# Altium schematic sheet CONNECTIVE.SchDoc
size A; SheetNumber: 8; SheetTotal: 10
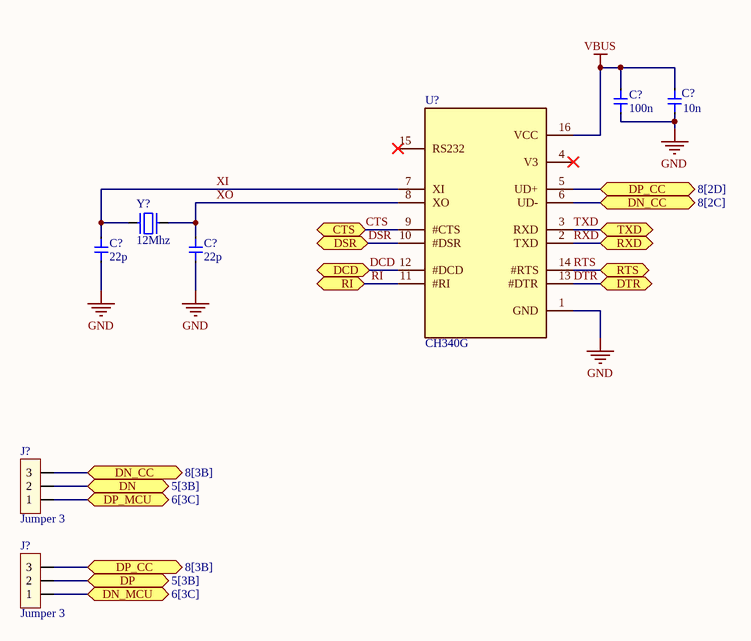
[diagram p0: CONNECTIVE.SchDoc]

## Parts
(Parts that share a designator on the sheet are numbered #1, #2 ... from top to bottom, then left to right.)
C?#1  100n  [Cap 0603]
C?#2  10n  [Cap 0603]
C?#3  22p  [Cap 0603]
C?#4  22p  [Cap 0603]
J?#1  Jumper 3  [JP3]
J?#2  Jumper 3  [JP3]
U?  CH340G  [CH340G]
Y?  12Mhz  [Thach Anh 2 chan SMD5032]

## Ports
CTS (bidir), DCD (bidir), DN (bidir, see 5[3B]), DN_CC (bidir, see 8[2C]), DN_CC (bidir, see 8[3B]), DN_MCU (bidir, see 6[3C]), DP (bidir, see 5[3B]), DP_CC (bidir, see 8[2D]), DP_CC (bidir, see 8[3B]), DP_MCU (bidir, see 6[3C]), DSR (bidir), DTR (bidir), RI (bidir), RTS (bidir), RXD (bidir), TXD (bidir)

## Nets
GND: C?#1.1 C?#2.2 C?#3.2 C?#4.2 U?.1(GND)
VBUS: C?#1.2 C?#2.1 U?.16(VCC)
CTS: U?.9(#CTS) ; port CTS
DCD: U?.12(#DCD) ; port DCD
DN: J?#1.2 ; port DN
DN_CC: J?#1.3 U?.6(UD-) ; port DN_CC
DN_MCU: J?#2.1 ; port DN_MCU
DP: J?#2.2 ; port DP
DP_CC: J?#2.3 U?.5(UD+) ; port DP_CC
DP_MCU: J?#1.1 ; port DP_MCU
DSR: U?.10(#DSR) ; port DSR
DTR: U?.13(#DTR) ; port DTR
RI: U?.11(#RI) ; port RI
RTS: U?.14(#RTS) ; port RTS
RXD: U?.2(TXD) ; port RXD
TXD: U?.3(RXD) ; port TXD
XI: C?#3.1 U?.7(XI) Y?.1
XO: C?#4.1 U?.8(XO) Y?.2

Not connected (* = marked no-connect by the designer): U? 4(V3)* 15(RS232)*

## Library data of the parts
C?#1-C?#4 = Cap 0603: Capacitor SMD 0603
J?#1 J?#2 = JP3: Value: J3
Y? = Thach Anh 2 chan SMD 5032: Crystal For all Crystal 2pin.; Value: 4Mhz